# EAGLE design Brians test board 1.19 (EAGLE 6.5.0)
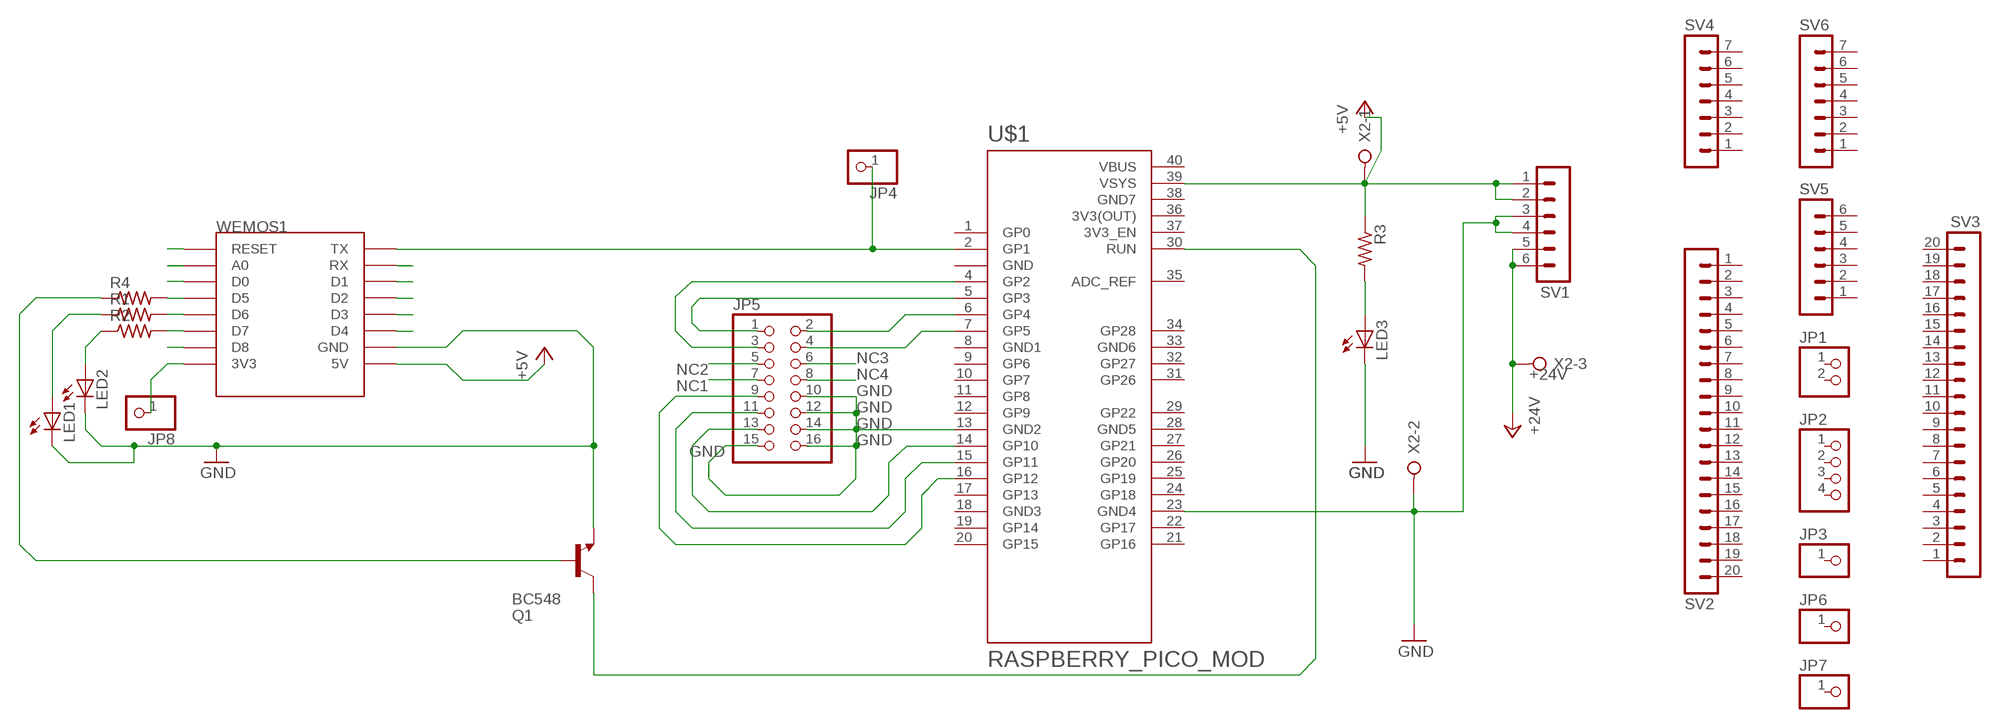
[diagram p0: schematic, sheet 1]

## Parts
JP1  PINHD-1X2  [1X02]
JP2  PINHD-1X4  [1X04]
JP3  PINHD-1X1  [1X01]
JP4  PINHD-1X1  [1X01]
JP5  PINHD-2X8  [2X08]
JP6  PINHD-1X1  [1X01]
JP7  PINHD-1X1  [1X01]
JP8  PINHD-1X1  [1X01]
LED1  LED3MM  [LED3MM]
LED2  LED3MM  [LED3MM]
LED3  LED3MM  [LED3MM]
Q1  BC548  [TO92-EBC]
R1  R-US_0204/2V  [0204V]
R2  R-US_0204/2V  [0204V]
R3  R-US_0207/10  [0207/10]
R4  R-US_0204/2V  [0204V]
SV1  MA06-1  [MA06-1]
SV2  MA20-1  [MA20-1]
SV3  MA20-1  [MA20-1]
SV4  MA07-1  [MA07-1]
SV5  MA06-1  [MA06-1]
SV6  MA07-1  [MA07-1]
U$1  RASPBERRY_PICO_MOD  [PICO-PKG-TH-LED]
WEMOS1  WEMOS-D1-MINI  [WEMOS-D1-MINI]
X2  W237-3E  [W237-3E]

## Nets
+5V: R3.1 SV1.1 SV1.2 U$1.39(VSYS) WEMOS1.5V X2.1
+24V: SV1.5 SV1.6 X2.3
A0: WEMOS1.A0
D0: WEMOS1.D0
D1: WEMOS1.D1
D2: WEMOS1.D2
D3: WEMOS1.D3
D4: WEMOS1.D4
D8: WEMOS1.D8
GND: JP5.10 JP5.12 JP5.14 JP5.15 JP5.16 LED1.K(C) LED2.K(C) LED3.K(C) Q1.E SV1.3 SV1.4 U$1.13(GND2) U$1.23(GND4) WEMOS1.GND X2.2
N$3: JP5.1 U$1.5(GP3)
N$4: JP8.1 WEMOS1.3V3
N$6: Q1.C U$1.30(RUN)
N$7: JP4.1 U$1.2(GP1) WEMOS1.TX
N$8: JP5.3 U$1.4(GP2)
N$9: R2.2 WEMOS1.D7
N$10: JP5.13 U$1.14(GP10)
N$11: JP5.11 U$1.15(GP11)
N$12: JP5.9 U$1.16(GP12)
N$13: JP5.2 U$1.6(GP4)
N$14: JP5.4 U$1.7(GP5)
N$15: R1.2 WEMOS1.D6
N$17: LED2.A R2.1
N$18: LED1.A R1.1
N$19: LED3.A R3.2
N$47: R4.2 WEMOS1.D5
N$48: Q1.B R4.1
NC1: JP5.7
NC2: JP5.5
NC3: JP5.6
NC4: JP5.8
RST: WEMOS1.RESET
RX: WEMOS1.RX
Unconnected: JP1.1 JP1.2 JP2.1 JP2.2 JP2.3 JP2.4 JP3.1 JP6.1 JP7.1 SV2.1 SV2.2 SV2.3 SV2.4 SV2.5 SV2.6 SV2.7 SV2.8 SV2.9 SV2.10 SV2.11 SV2.12 SV2.13 SV2.14 SV2.15 SV2.16 SV2.17 SV2.18 SV2.19 SV2.20 SV3.1 SV3.2 SV3.3 SV3.4 SV3.5 SV3.6 SV3.7 SV3.8 SV3.9 SV3.10 SV3.11 SV3.12 SV3.13 SV3.14 SV3.15 SV3.16 SV3.17 SV3.18 SV3.19 SV3.20 SV4.1 SV4.2 SV4.3 SV4.4 SV4.5 SV4.6 SV4.7 SV5.1 SV5.2 SV5.3 SV5.4 SV5.5 SV5.6 SV6.1 SV6.2 SV6.3 SV6.4 SV6.5 SV6.6 SV6.7 U$1.1(GP0) U$1.9(GP6) U$1.10(GP7) U$1.11(GP8) U$1.12(GP9) U$1.17(GP13) U$1.19(GP14) U$1.20(GP15) U$1.21(GP16) U$1.22(GP17) U$1.24(GP18) U$1.25(GP19) U$1.26(GP20) U$1.27(GP21) U$1.29(GP22) U$1.31(GP26) U$1.32(GP27) U$1.34(GP28) U$1.35(ADC_REF) U$1.37(3V3_EN)

## Power pins joined to a net without a drawn wire
3V3(OUT): U$1.36(3V3(OUT))
GND: U$1.3(GND)
GND1: U$1.8(GND1)
GND3: U$1.18(GND3)
GND5: U$1.28(GND5)
GND6: U$1.33(GND6)
GND7: U$1.38(GND7)
VBUS: U$1.40(VBUS)

## Library data of the parts
JP1 = pinhead:PINHD-1X2: PIN HEADER
JP2 = pinhead:PINHD-1X4: PIN HEADER
JP3 JP4 JP6-JP8 = pinhead:PINHD-1X1: PIN HEADER
JP5 = pinhead:PINHD-2X8: PIN HEADER
LED1-LED3 = led:LED: LED OSRAM: - CHIPLED LG R971, LG N971, LY N971, LG Q971, LY Q971, LO R971, LY R971 LH N974, LH R974 LS Q976, LO Q976, LY Q976 LO Q996 - Hyper CHIPLED LW Q18S LB Q993, LB Q99A, LB R99A - SideLED LS A670, LO A670, LY A670, LG A670, LP A670 LB A673, LV A673, LT A673, LW A673 LH A674 LY A675 LS A676, LA A676, LO A676, LY A676, LW A676 LS A679, LY A679, LG A679 - Hyper Micro SIDELED® LS Y876, LA Y876, LO Y876, LY Y876 LT Y87S - SmartLED LW L88C, LW L88S LB L89C, LB L89S, LG L890 LS L89K, LO L89K, LY L89K LS L896, LA L896, LO L896, LY L896 - TOPLED LS T670, LO T670, LY T670, LG T670, LP T670 LSG T670, LSP T670, LSY T670, LOP T670, LYG T670 LG T671, LOG T671, LSG T671 LB T673, LV T673, LT T673, LW T673 LH T674 LS T676, LA T676, LO T676, LY T676, LB T676, LH T676, LSB T676, LW T676 LB T67C, LV T67C, LT T67C, LS T67K, LO T67K, LY T67K, LW E67C LS E67B, LA E67B, LO E67B, LY E67B, LB E67C, LV E67C, LT E67C LW T67C LS T679, LY T679, LG T679 LS T770, LO T770, LY T770, LG T770, LP T770 LB T773, LV T773, LT T773, LW T773 LH T774 LS E675, LA E675, LY E675, LS T675 LS T776, LA T776, LO T776, LY T776, LB T776 LHGB T686 LT T68C, LB T68C - Hyper Mini TOPLED® LB M676 - Mini TOPLED Santana® LG M470 LS M47K, LO M47K, LY M47K Source: http://www.osram.convergy.de LUXEON: - LUMILED® LXK2-PW12-R00, LXK2-PW12-S00, LXK2-PW14-U00, LXK2-PW14-V00 LXK2-PM12-R00, LXK2-PM12-S00, LXK2-PM14-U00 LXK2-PE12-Q00, LXK2-PE12-R00, LXK2-PE12-S00, LXK2-PE14-T00, LXK2-PE14-U00 LXK2-PB12-K00, LXK2-PB12-L00, LXK2-PB12-M00, LXK2-PB14-N00, LXK2-PB14-P00, LXK2-PB14-Q00 LXK2-PR12-L00, LXK2-PR12-M00, LXK2-PR14-Q00, LXK2-PR14-R00 LXK2-PD12-Q00, LXK2-PD12-R00, LXK2-PD12-S00 LXK2-PH12-R00, LXK2-PH12-S00 LXK2-PL12-P00, LXK2-PL12-Q00, LXK2-PL12-R00 Source: www.luxeon.com KINGBRIGHT: KA-3528ASYC Source: www.kingbright.com
Q1 = transistor-npn:BC548*: NPN Transistor
R1-R4 = rcl:R-US_: RESISTOR, American symbol
SV1 SV5 = con-lstb:MA06-1: PIN HEADER; OC_FARNELL: unknown; OC_NEWARK: unknown
SV2 SV3 = con-lstb:MA20-1: PIN HEADER; OC_FARNELL: unknown; OC_NEWARK: unknown
SV4 SV6 = con-lstb:MA07-1: PIN HEADER; OC_FARNELL: unknown; OC_NEWARK: unknown
U$1 = Rip-Mod:RASPBERRY_PICO_MOD
WEMOS1 = esp8266modules:WEMOS-D1-MINI: WeMos.cc D1 mini ESP8266 module
X2 = con-wago-508:W237-3E: WAGO SREW CLAMP; OC_FARNELL: unknown; OC_NEWARK: unknown

## Board
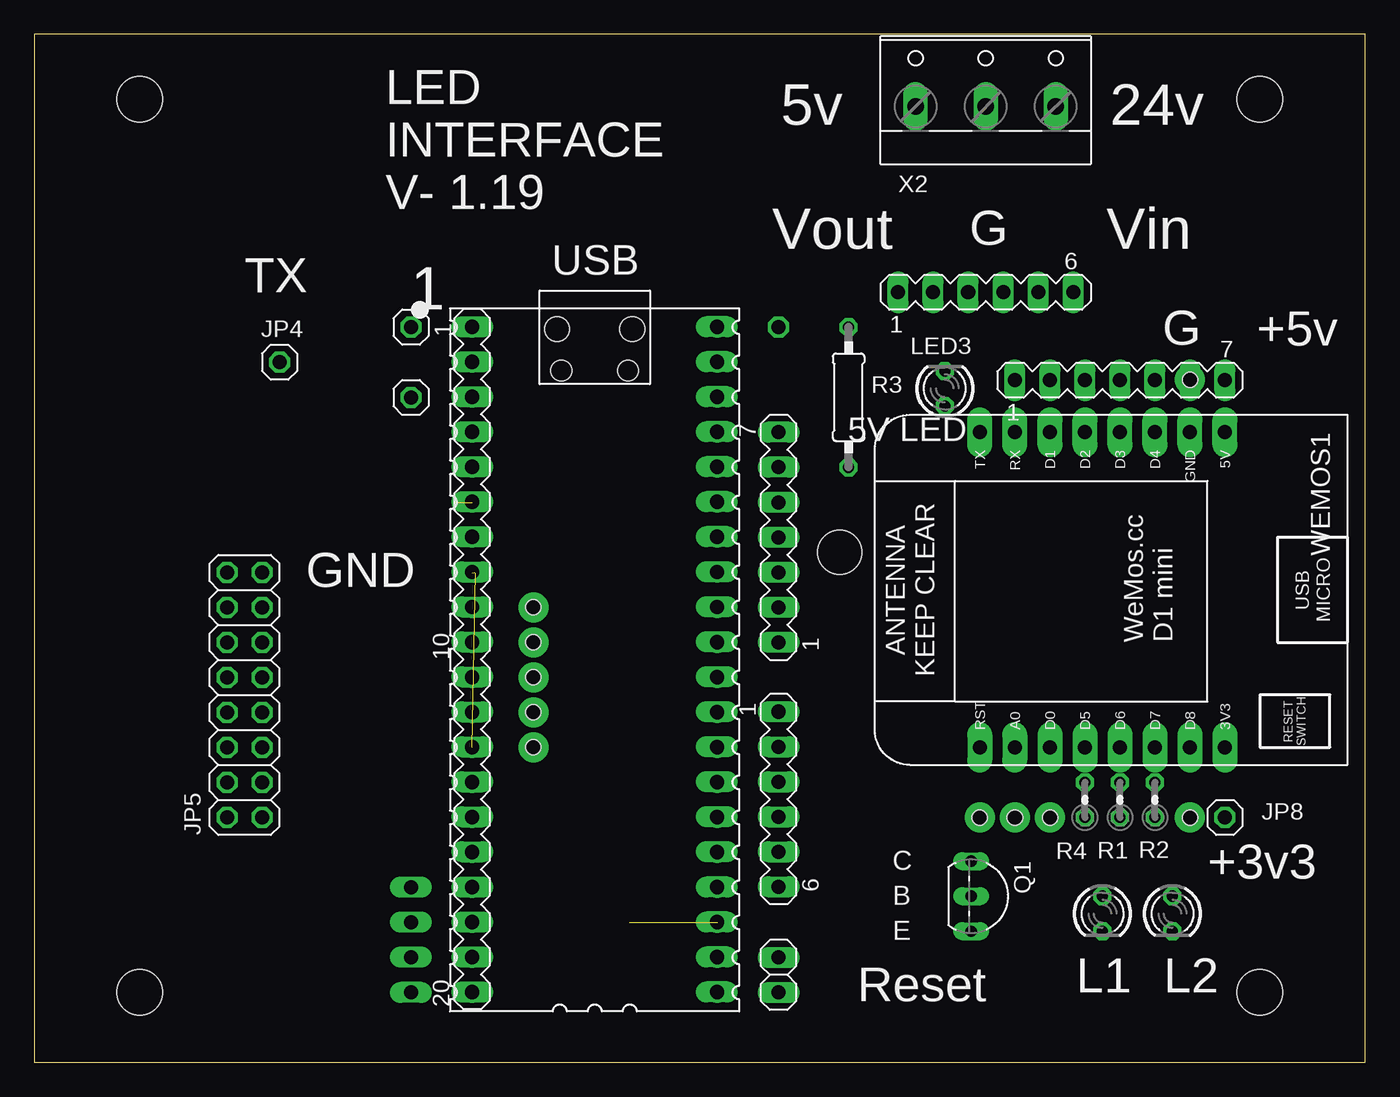
[diagram p1: board, top side]
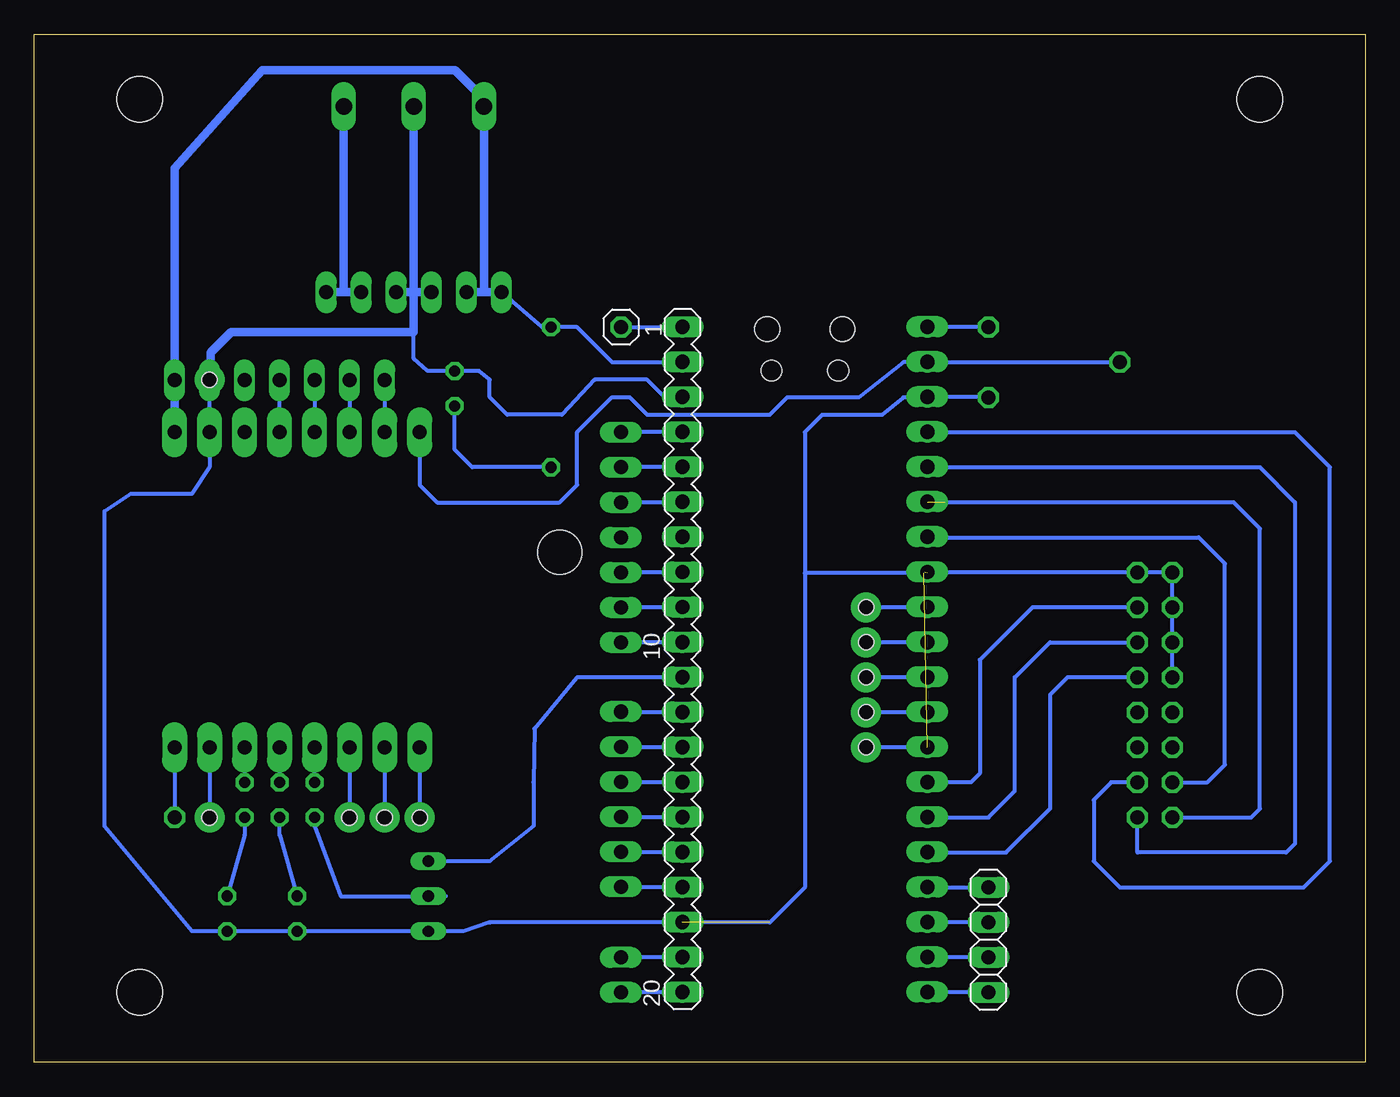
[diagram p2: board, bottom side, seen from below]

Size 96.52 x 74.58 mm. Coordinates in mm from the lower left corner, seen from the top.
Outline: 0,0 96.52,0 96.52,74.58 0,74.58 0,0
Copper layers (1*16): Top 0.035mm / dielectric 1.5mm / Bottom 0.035mm
Design rules "default": minimum track width 10mil, minimum drill 24mil, track to track 8mil, track to pad 8mil, pad to pad 8mil, via to via 8mil, smd to smd 8mil, copper to edge 40mil, drill to drill 8mil, minimum pad ring 10mil, minimum via ring 8mil, stop-mask expansion 4mil, vias tented up to drill 0mil, thermal gap 10mil
Holes 3.3 mm at 7.62,69.88 88.9,69.88 7.62,5.08 88.9,5.08
Holes 1.1 mm at 36.2,33.02 36.2,30.48 36.2,27.94 36.2,25.4 36.2,22.86 68.58,17.75 71.12,17.75 73.66,17.75 83.82,17.75 83.82,49.53
Holes 3.2 mm at 58.42,37.02

### Footprints (pad centres in the part's own frame; a part is rotated, then mirrored left to right if it is on the bottom)
1X02 = drill 1.016 long: 1 -1.27,0; 2 1.27,0
1X04 = drill 1.016 long: 1 -3.81,0; 2 -1.27,0; 3 1.27,0; 4 3.81,0
1X01 = drill 1.016 octagon: 1 0,0
2X08 = drill 1.016 octagon: 1 -8.89,-1.27; 2 -8.89,1.27; 3 -6.35,-1.27; 4 -6.35,1.27; 5 -3.81,-1.27; 6 -3.81,1.27; 7 -1.27,-1.27; 8 -1.27,1.27; 9 1.27,-1.27; 10 1.27,1.27; 11 3.81,-1.27; 12 3.81,1.27; 13 6.35,-1.27; 14 6.35,1.27; 15 8.89,-1.27; 16 8.89,1.27
LED3MM = drill 0.813 octagon: A -1.27,0; K 1.27,0
TO92-EBC = drill 0.813 long: B 0,-1.27; C -2.54,-1.27; E 2.54,-1.27
0204V = drill 0.813 octagon: 1 -1.27,0; 2 1.27,0
0207/10 = drill 0.813 octagon: 1 -5.08,0; 2 5.08,0
MA06-1 = drill 1.016 long: 1 -6.35,0; 2 -3.81,0; 3 -1.27,0; 4 1.27,0; 5 3.81,0; 6 6.35,0
MA20-1 = drill 1.016 long: 1 -24.13,0; 2 -21.59,0; 3 -19.05,0; 4 -16.51,0; 5 -13.97,0; 6 -11.43,0; 7 -8.89,0; 8 -6.35,0; 9 -3.81,0; 10 -1.27,0; 11 1.27,0; 12 3.81,0; 13 6.35,0; 14 8.89,0; 15 11.43,0; 16 13.97,0; 17 16.51,0; 18 19.05,0; 19 21.59,0; 20 24.13,0
MA07-1 = drill 1.016 long: 1 -7.62,0; 2 -5.08,0; 3 -2.54,0; 4 0,0; 5 2.54,0; 6 5.08,0; 7 7.62,0
PICO-PKG-TH-LED = drill 1: 1 -7.62,25.4; 2 -7.62,22.86; 3 -7.62,20.32; 4 -7.62,17.78; 5 -7.62,15.24; 6 -7.62,12.7; 7 -7.62,10.16; 8 -7.62,7.62; 9 -7.62,5.08; 10 -7.62,2.54; 11 -7.62,0; 12 -7.62,-2.54; 13 -7.62,-5.08; 14 -7.62,-7.62; 15 -7.62,-10.16; 16 -7.62,-12.7; 17 -7.62,-15.24; 18 -7.62,-17.78; 19 -7.62,-20.32; 20 -7.62,-22.86; 21 10.16,-22.86; 22 10.16,-20.32; 23 10.16,-17.78; 24 10.16,-15.24; 25 10.16,-12.7; 26 10.16,-10.16; 27 10.16,-7.62; 28 10.16,-5.08; 29 10.16,-2.54; 30 10.16,0; 31 10.16,2.54; 32 10.16,5.08; 33 10.16,7.62; 34 10.16,10.16; 35 10.16,12.7; 36 10.16,15.24; 37 10.16,17.78; 38 10.16,20.32; 39 10.16,22.86; 40 10.16,25.4 | hole 1.8: -1.455,25.27; 3.995,25.27 | hole 1.5: -1.155,22.24; 3.695,22.24
WEMOS-D1-MINI = drill 1.016 pad 1.829 long: 3V3 -10.16,-10.16; 5V 12.7,-10.16; A0 -10.16,5.08; D0 -10.16,2.54; D1 12.7,2.54; D2 12.7,0; D3 12.7,-2.54; D4 12.7,-5.08; D5 -10.16,0; D6 -10.16,-2.54; D7 -10.16,-5.08; D8 -10.16,-7.62; GND 12.7,-7.62; RESET -10.16,7.62; RX 12.7,5.08; TX 12.7,7.62
W237-3E = drill 1.194 long: 1 -5.08,-0.635; 2 0,-0.635; 3 5.08,-0.635

### Placement (x,y rotation side)
JP1  53.98,6.35 270 top
JP2  27.3,8.9 270 bottom
JP3  53.98,53.35 0 bottom
JP4  17.78,50.8 0 top
JP5  15.24,26.67 90 top
JP6  27.3,53.35 0 top
JP7  27.3,48.25 0 top
JP8  86.36,17.78 0 top
LED1  77.47,10.79 270 top
LED2  82.55,10.79 270 top
LED3  66.04,48.9 90 top
Q1  69.22,12.06 270 top
R1  78.74,19.05 90 top
R2  81.28,19.05 90 top
R3  59.05,48.26 270 top
R4  76.2,19.05 90 top
SV1  69,55.88 0 top
SV2  31.75,29.25 270 top
SV3  49.5,29.25 270 bottom
SV4  53.98,38.1 90 top
SV5  53.98,19.1 270 top
SV6  78.74,49.5 0 top
U$1  39.37,27.94 0 top
WEMOS1  76.2,33.02 90 top
X2  69,70 0 top

### Tracks (layer width: path | path; a pad name or v marks a point on that pad's centre or on a via)
+5V
  Bottom 0.3: WEMOS1.5V 86.36,44.45 | 54.61,50.8 57.15,53.34 R3.1 59.69,53.34 SV1.1
  Bottom 0.305: 54.61,50.8 U$1.39
  Bottom 0.61: 63.92,55.88 X2.1 64,68.94 64,70 66,72 80,72 86.36,64.89 WEMOS1.5V | SV1.1 63.92,55.88 | 63.92,55.88 SV1.2
+24V
  Bottom 0.61: SV1.5 74,55.88 | 74,55.88 SV1.6 | 74,55.88 74.08,55.96 X2.3
A0  (via drill 0.6 pad 2.18)
  Bottom 0.3: v71.12,17.78 WEMOS1.A0 71.12,24.13
D0  (via drill 0.6 pad 2.18)
  Bottom 0.3: v73.66,17.78 WEMOS1.D0 73.66,24.13
D8  (via drill 0.6 pad 2.18)
  Bottom 0.3: v83.82,17.78 WEMOS1.D8 83.82,24.13
GND  (via drill 0.6 pad 2.18)  (3 unrouted)
  Bottom 0.3: JP5.10 JP5.12 JP5.14 JP5.16 | 63.5,10.16 65.41,9.53 Q1.E LED1.K LED2.K 85.09,9.53 91.44,17.14 91.44,40.01 89.53,41.27 85.09,41.27 83.82,43.18 WEMOS1.GND v83.82,49.53 | 49.8,48.26 50.8,48.26 52.07,49.53 55.88,49.53 58.25,46.99 62.23,46.99 63.5,48.26 63.5,49.53 64.27,50.16 LED3.K 68,50.16 69,51.07 69,53.15
  Bottom 0.305: JP5.16 31.94,35.56 32,35.5 40.64,35.5 | U$1.3 33.5,48.26 33.5,48.25 35.01,47 39.36,47 40.64,45.72 40.64,35.5 | 40.64,35.5 40.64,12.7 43.18,10.16 63.5,10.16 | JP5.15 31.69,35.56 31.75,35.5
  Bottom 0.61: SV1.3 69,55.88 | 69,55.88 SV1.4 | X2.2 69,55.88 | 69,55.88 69,53.15 69,53 82.25,53 83.75,51.5 83.75,49.6 v83.82,49.53
N$1
  Bottom 0.3: 53.98,53.34 48.9,53.34
N$3
  Bottom 0.3: 7.62,43.18 5.08,40.64 5.08,15.88 5.71,15.24 16.51,15.24 JP5.1
  Bottom 0.305: U$1.5 7.62,43.18
N$4
  Bottom 0.3: JP8.1 WEMOS1.3V3 86.36,24.13
N$5
  Bottom 0.3: 27.3,53.34 31.75,53.34
N$6
  Bottom 0.3: 50.8,27.94 57.15,27.94 60.25,24.21 60.33,20.32 60.33,17.14 63.5,14.61 Q1.C 68.58,14.61
  Bottom 0.305: 50.8,27.94 U$1.30
N$7
  Bottom 0.3: WEMOS1.TX 68.58,41.91 67.31,40.64 58.42,40.64 57.15,41.91 57.15,45.72 54.61,48.26 53.34,48.26 52.07,46.99 43.18,46.99 41.91,48.26 39.37,48.26
  Bottom 0.305: 39.37,48.26 36.8,48.26 36.75,48.25 33.5,50.8 U$1.2 JP4.1
N$8
  Bottom 0.3: 5.08,45.72 2.54,43.18 2.54,14.61 4.45,12.7 17.78,12.7 19.68,14.61 19.68,19.05 18.41,20.32 JP5.3
  Bottom 0.305: U$1.4 5.08,45.72
N$9
  Bottom 0.3: R2.2 WEMOS1.D7 81.28,24.13
N$10
  Bottom 0.3: JP5.13 24.13,33.02 27.94,29.21 27.94,20.95 28.57,20.32 30.48,20.32
  Bottom 0.305: U$1.14 30.48,20.32
N$11
  Bottom 0.3: 30.48,17.78 27.3,17.78 25.4,19.68 25.4,27.94 22.86,30.48 JP5.11
  Bottom 0.305: U$1.15 30.48,17.78
N$12
  Bottom 0.3: JP5.9 21.59,27.94 22.86,26.67 22.86,18.41 26.04,15.24
  Bottom 0.305: U$1.16 26.04,15.24
N$13  (1 unrouted)
  Bottom 0.3: JP5.2 8.26,17.78 7.62,18.41 7.62,38.73 9.53,40.64 30.48,40.64
N$14
  Bottom 0.3: JP5.4 11.43,20.32 10.16,21.59 10.16,36.2 12.06,38.1
  Bottom 0.305: U$1.7 12.06,38.1
N$15
  Bottom 0.3: R1.2 WEMOS1.D6 78.74,24.13
N$17
  Bottom 0.3: R2.1 81.28,16.51 LED2.A
N$18
  Bottom 0.3: LED1.A 78.74,16.51 R1.1
N$19
  Bottom 0.3: R3.2 64.77,43.18 66.04,44.45 LED3.A
N$20
  Bottom 0.3: 32.38,12.7 27.3,12.7
N$21
  Bottom 0.3: 26.67,10.16 32.38,10.16
N$22
  Bottom 0.3: 26.67,7.62 32.38,7.62
N$23
  Bottom 0.3: 26.67,5.08 32.38,5.08
N$24
  Bottom 0.3: 48.9,5.08 53.98,5.08
N$25
  Bottom 0.3: 48.9,7.62 53.98,7.62
N$26
  Bottom 0.3: 48.9,12.7 53.98,12.7
N$27
  Bottom 0.3: 48.9,15.24 53.98,15.24
N$28
  Bottom 0.3: 48.9,17.78 53.98,17.78
N$29
  Bottom 0.3: 48.9,20.32 53.98,20.32
N$30
  Bottom 0.3: 48.9,22.86 53.98,22.86
N$31
  Bottom 0.3: 48.9,30.48 53.98,30.48
N$32
  Bottom 0.3: 48.9,33.02 53.98,33.02
N$34
  Bottom 0.3: 48.9,35.56 53.98,35.56
N$36
  Bottom 0.3: 48.9,40.64 53.98,40.64
N$42  (via drill 0.6 pad 2.18)
  Bottom 0.3: v36.2,33.02 33.02,33.02 31.75,33.02 31.11,33.02
N$43  (via drill 0.6 pad 2.18)
  Bottom 0.3: 31.11,30.48 v36.2,30.48
N$44  (via drill 0.6 pad 2.18)
  Bottom 0.3: v36.2,27.94 33.02,27.94 31.75,27.94 31.11,27.94
N$45  (via drill 0.6 pad 2.18)
  Bottom 0.3: 31.11,25.4 v36.2,25.4
N$46  (via drill 0.6 pad 2.18)
  Bottom 0.3: v36.2,22.86 33.02,22.86 31.75,22.86 31.11,22.86
N$47
  Bottom 0.3: R4.2 WEMOS1.D5 76.2,24.13
N$48
  Bottom 0.3: R4.1 76.2,17.14 74.3,12.06 Q1.B 66.67,12.06
N$49
  Bottom 0.3: 73.66,49.53 73.66,44.45
N$50
  Bottom 0.3: 71.12,49.53 71.12,44.45
N$57
  Bottom 0.305: 27.3,48.26 31.74,48.26 31.75,48.25
N$58
  Bottom 0.3: 48.9,45.72 53.98,45.72
N$59
  Bottom 0.3: 48.9,43.18 53.98,43.18
N$60
  Bottom 0.3: 48.9,25.4 53.98,25.4
N$63
  Bottom 0.3: 76.2,49.53 76.2,44.45
N$64
  Bottom 0.3: 78.74,44.45 78.74,49.53
RST  (via drill 0.6 pad 2.18)
  Bottom 0.3: v68.58,17.78 WEMOS1.RESET 68.58,24.13

### Text on the board
tPlace: 5v | 24v | LED / INTERFACE / V- 1.19 | Vout | G | Vin | USB | TX | 1 | G | +5v | 5V LED | GND | C | +3v3 | B | E | L1 | L2 | Reset